# Altium schematic sheet lte.SchDoc
size A3; SheetNumber: 5; SheetTotal: 7
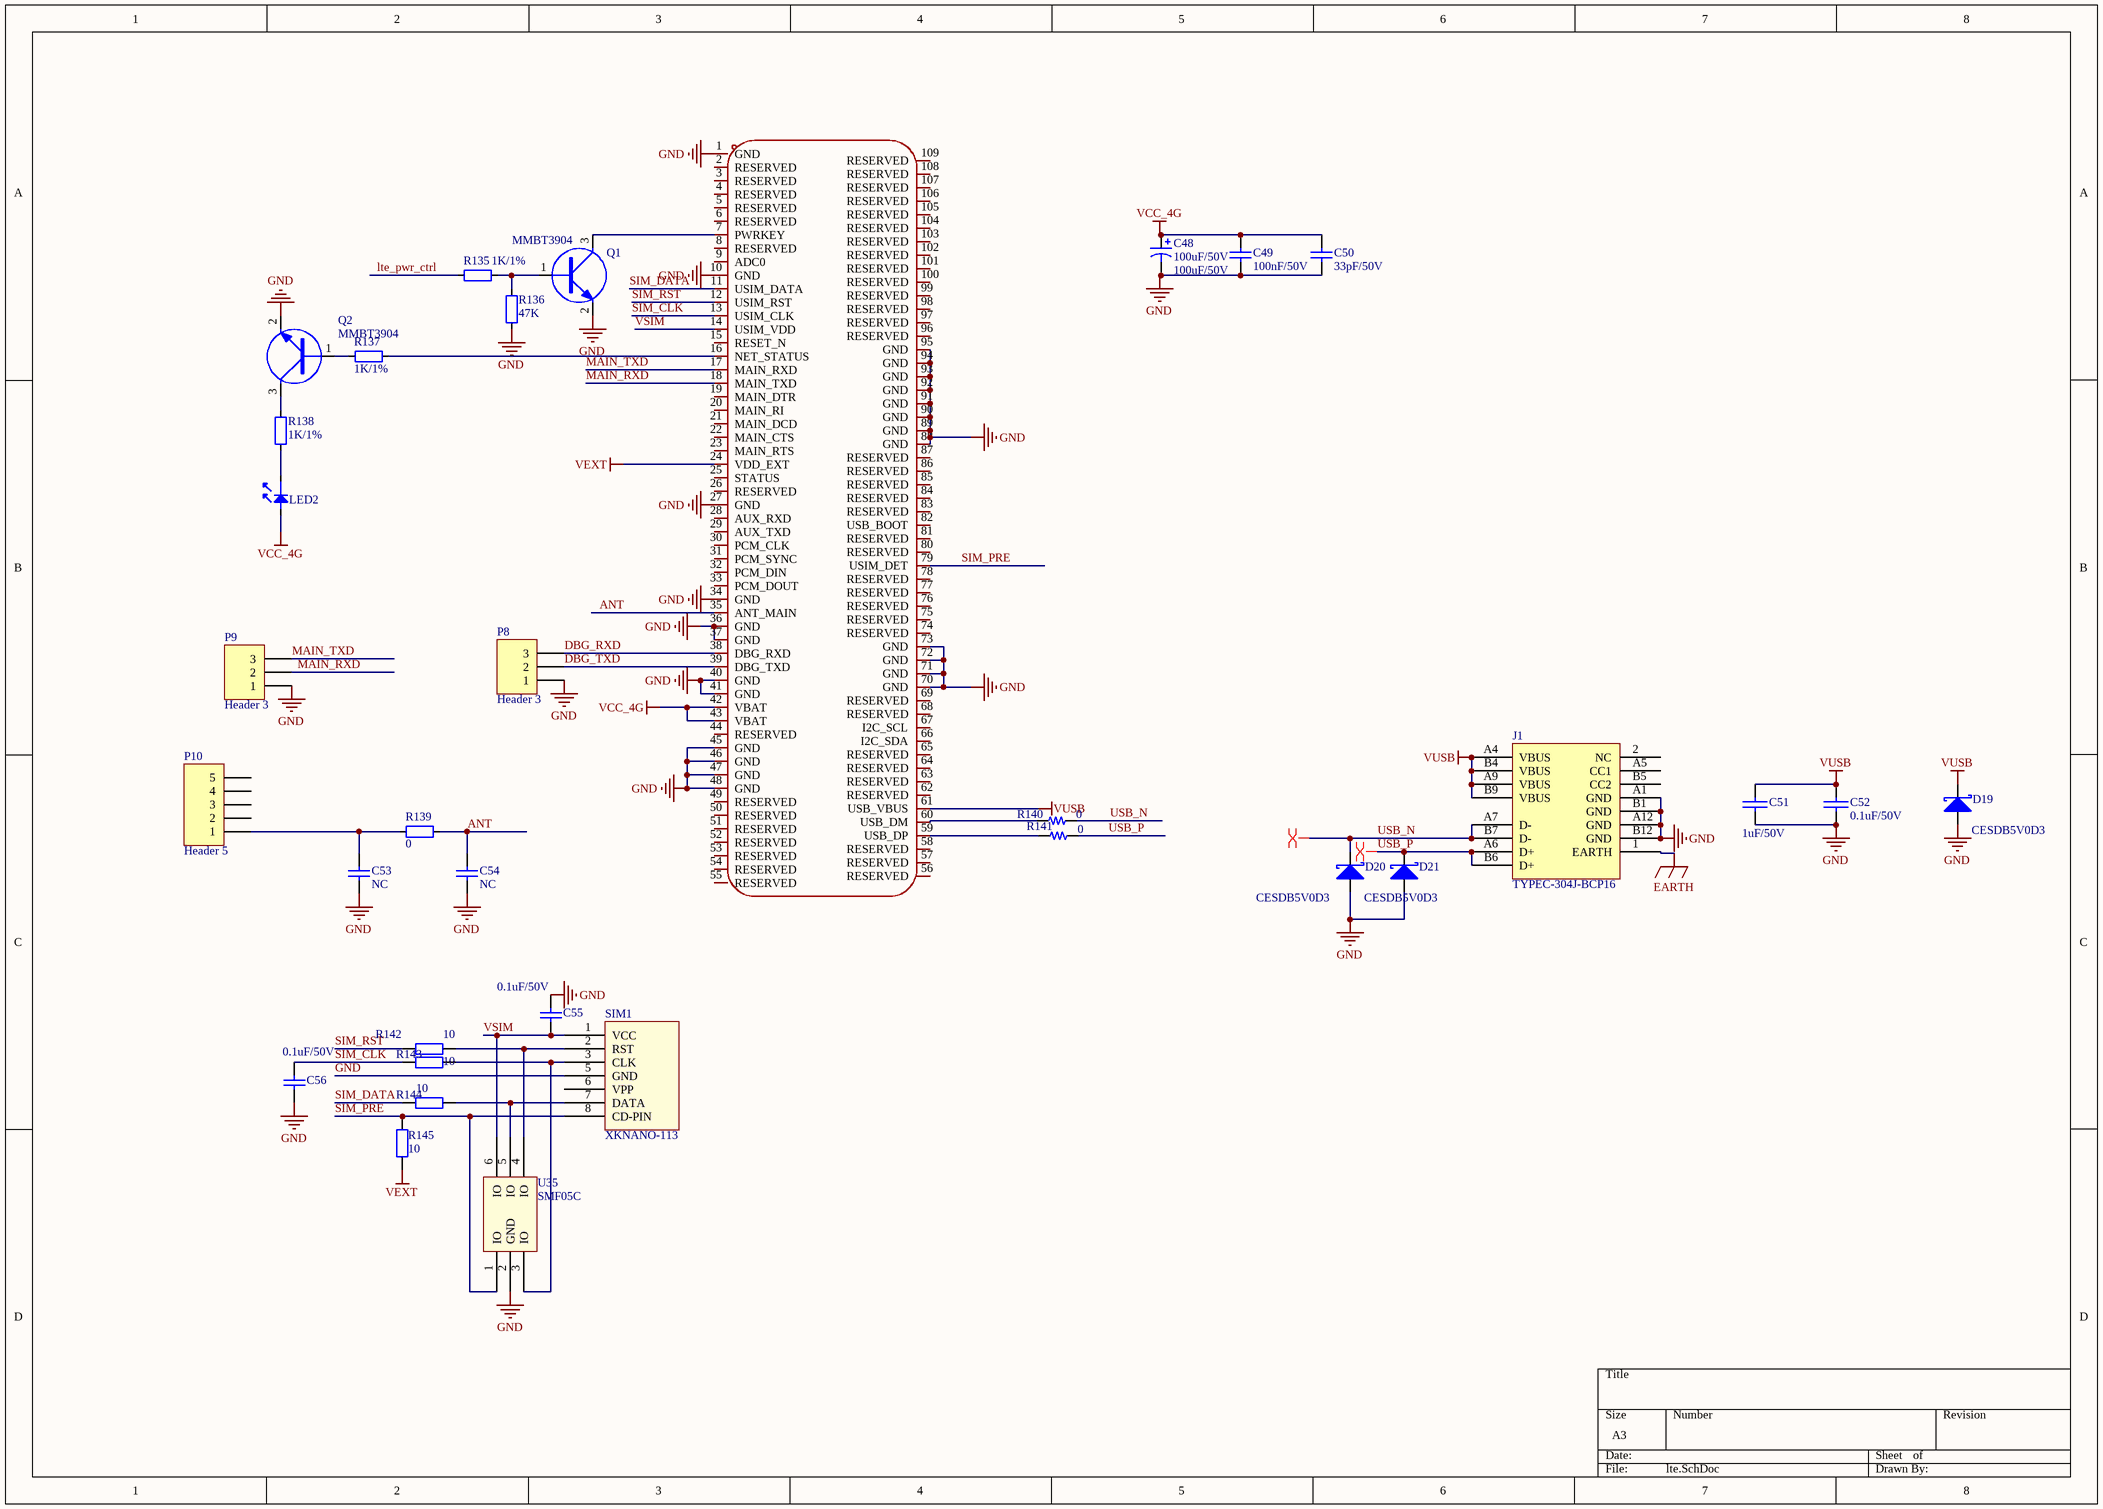
[diagram p0: lte.SchDoc]

## Parts
C48  100uF/50V  [CAP-SMD_BD6.3-L6.5-W6.5-LS7.0-FD]
C49  100nF/50V  [0603C]
C50  33pF/50V  [0603C]
C51  1uF/50V  [CAPC1608X092N_0603]
C52  0.1uF/50V  [CAPC1608X092N_0603]
C53  NC  [0603c]  (no BOM)
C54  NC  [0603c]  (no BOM)
C55  0.1uF/50V  [0603c]
C56  0.1uF/50V  [0603c]  (no BOM)
D19  CESDB5V0D3  [SOD323]
D20  CESDB5V0D3  [SOD323]
D21  CESDB5V0D3  [SOD323]
J1  TYPEC-304J-BCP16  [TYPEC_16P]
LED2  LED_Green_19-217  [0603led]  (value not drawn)
P8  Header 3  [HDR1X3]
P9  Header 3  [HDR1X3]
P10  Header 5  [KH-SMA-KE-Z]
Q1  MMBT3904  [SOT23-3]
Q2  MMBT3904  [SOT23-3]
R135  1K/1%  [0603R]
R136  47K  [0603r]
R137  1K/1%  [0603r]
R138  1K/1%  [0603R]
R139  0  [0603r]
R140  0  [RESC1608X055N_0603]  (no BOM)
R141  0  [RESC1608X055N_0603]  (no BOM)
R142  10  [0603r]
R143  10  [0603r]
R144  10  [0603r]
R145  10  [0603r]
SIM1  XKNANO-113  [Nano SIM]
U34  EC800ECNNQ-N03-SNNSA  [LCC-LGA-109_L17.7-W15.8-P1.10_MC661]  (value not drawn)
U35  SMF05C  [sc70-6l]

## Nets
EARTH: J1.1(EARTH)
GND: C48.2 C49.1 C50.1 C51.1 C52.1 C53.2 C54.2 C55.1 C56.2 D19.1(A) D20.1(A) D21.1(A) J1.A1(GND) J1.A12(GND) J1.B1(GND) J1.B12(GND) P8.1 P9.1 Q1.2(E) Q2.2(E) R136.1 SIM1.5(GND) U34.1(GND) U34.10(GND) U34.27(GND) U34.34(GND) U34.36(GND) U34.37(GND) U34.40(GND) U34.41(GND) U34.45(GND) U34.46(GND) U34.47(GND) U34.48(GND) U34.70(GND) U34.71(GND) U34.72(GND) U34.73(GND) U34.88(GND) U34.89(GND) U34.90(GND) U34.91(GND) U34.92(GND) U34.93(GND) U34.94(GND) U34.95(GND) U35.2(GND)
VCC_4G: C48.1 C49.2 C50.2 LED2.1 U34.42(VBAT) U34.43(VBAT)
VEXT: R145.2 U34.24(VDD_EXT)
VUSB: C51.2 C52.2 D19.2(K) J1.A4(VBUS) J1.A9(VBUS) J1.B4(VBUS) J1.B9(VBUS) U34.61(USB_VBUS)
ANT: C54.1 R139.1 U34.35(ANT_MAIN)
DBG_RXD: P8.3 U34.38(DBG_RXD)
DBG_TXD: P8.2 U34.39(DBG_TXD)
lte_pwr_ctrl: R135.1
MAIN_RXD: P9.2 U34.18(MAIN_TXD)
MAIN_TXD: P9.3 U34.17(MAIN_RXD)
SIM_CLK: C56.1 R143.2 U34.13(USIM_CLK)
SIM_DATA: R144.2 U34.11(USIM_DATA)
SIM_PRE: R145.1 SIM1.8(CD-PIN) U34.79(USIM_DET) U35.1(IO)
SIM_RST: R142.2 U34.12(USIM_RST)
USB_N: D20.2(K) J1.A7(D-) J1.B7(D-) R140.1
USB_P: D21.2(K) J1.A6(D+) J1.B6(D+) R141.1
VSIM: C55.2 SIM1.1(VCC) U34.14(USIM_VDD) U35.6(IO)
NetC53_1: C53.1 P10.1 R139.2
NetLED2_2: LED2.2 R138.1
NetQ1_1: Q1.1(B) R135.2 R136.2
NetQ1_3: Q1.3(C) U34.7(PWRKEY)
NetQ2_1: Q2.1(B) R137.2
NetQ2_3: Q2.3(C) R138.2
NetR137_1: R137.1 U34.16(NET_STATUS)
NetR140_2: R140.2 U34.60(USB_DM)
NetR141_2: R141.2 U34.59(USB_DP)
NetR142_1: R142.1 SIM1.2(RST) U35.4(IO)
NetR143_1: R143.1 SIM1.3(CLK) U35.3(IO)
NetR144_1: R144.1 SIM1.7(DATA) U35.5(IO)

Not connected (* = marked no-connect by the designer): J1 2(NC) A5(CC1) B5(CC2); P10 2 3 4 5; SIM1 6(VPP); U34 2(RESERVED) 3(RESERVED) 4(RESERVED) 5(RESERVED) 6(RESERVED) 8(RESERVED) 9(ADC0) 15(RESET_N) 19(MAIN_DTR) 20(MAIN_RI) 21(MAIN_DCD) 22(MAIN_CTS) 23(MAIN_RTS) 25(STATUS) 26(RESERVED) 28(AUX_RXD) 29(AUX_TXD) 30(PCM_CLK) 31(PCM_SYNC) 32(PCM_DIN) 33(PCM_DOUT) 44(RESERVED) 49(RESERVED) 50(RESERVED) 51(RESERVED) 52(RESERVED) 53(RESERVED) 54(RESERVED) 55(RESERVED) 56(RESERVED) 57(RESERVED) 58(RESERVED) 62(RESERVED) 63(RESERVED) 64(RESERVED) 65(RESERVED) 66(I2C_SDA) 67(I2C_SCL) 68(RESERVED) 69(RESERVED) 74(RESERVED) 75(RESERVED) 76(RESERVED) 77(RESERVED) 78(RESERVED) 80(RESERVED) 81(RESERVED) 82(USB_BOOT) 83(RESERVED) 84(RESERVED) 85(RESERVED) 86(RESERVED) 87(RESERVED) 96(RESERVED) 97(RESERVED) 98(RESERVED) 99(RESERVED) 100(RESERVED) 101(RESERVED) 102(RESERVED) 103(RESERVED) 104(RESERVED) 105(RESERVED) 106(RESERVED) 107(RESERVED) 108(RESERVED) 109(RESERVED)

## Layout directives
differential pair: USB_N, USB_P

## Library data of the parts
C48 = Cap Pol3: Polarized Capacitor (Surface Mount); Value: 100uF/50V
C49 C50 C53 C54 = Cap: Capacitor
  C49: Value: 100nF/50V
  C50: Value: 33pF/50V
  C53 C54: Value: NC
C51 = CAP: PartNumber: CL10A105KB8NNNC; Value: 1uF/50V; Package: 0603
C52 = CAP: PartNumber: CC0603KRX7R9BB104; Value: 0.1uF/50V; Package: 0603
C55 C56 = Cap: Capacitor; Value: 0.1uF/10V
D19-D21 = DIODE S: PartNumber: CESDB5V0D3
  D21: Value: CESDB5V0D3
J1 = TYPE C_16P: Value: TYPEC-304J-BCP16; PartNumber: TYPEC-304J-BCP16
LED2 = LED_Green_19-217: 物料主编码(PN): 100000032; Value: 19-217/G7C-AN1P2/3T; 序号: 33; 物料名称: 绿色LED; 物料描述: Other,LED,绿色,0603,1.6X0.8X0.4mm,19-217/G7C-AN1P2/3T; 工作温度: –40°C to 85°C; 制造商: Everlight; 器件等级: ——; 物料类型: 特殊二极管; 规格型号(完整型号): 19-217/G7C-AN1P2/3T
P8 P9 = Header 3: Header, 3-Pin
P10 = Header 5: Header, 5-Pin
Q1 Q2 = NPN_MMBT3904
R135 R137 R138 = RES0603: 物料主编码(PN): 150000040; Value: 1K; 序号: 109; 物料名称: 贴片电阻; 精度: ±1%; 规格型号(完整型号): RC1608F103CS/RC0603FR-0710KL; 物料描述: RES,贴片电阻,0603,10k,±1%,1/10W,1.6X0.8X0.45mm,RC1608F103CS/RC0603FR-0710KL; 工作温度: –55°C to 155°C; 制造商: 三星/YAGEO; 器件等级: ——; 物料类型: 表贴电阻; 参数值: 1.00E+04
R136 R139 = RES0603: 物料主编码(PN): 150000040; 序号: 109; 物料名称: 贴片电阻; 精度: ±1%; 规格型号(完整型号): RC1608F103CS/RC0603FR-0710KL; 物料描述: RES,贴片电阻,0603,10k,±1%,1/10W,1.6X0.8X0.45mm,RC1608F103CS/RC0603FR-0710KL; 工作温度: –55°C to 155°C; 制造商: 三星/YAGEO; 器件等级: ——; 物料类型: 表贴电阻; 参数值: 1.00E+04
  R136: Value: 47K
  R139: Value: 0
R140 R141 = R: PartNumber: RC0603FR-071KL; Value: 0; Package: 0603
R142-R145 = Res2: Resistor; Value: 10R
SIM1 = nano sim